# EAGLE design MJ818 clone - rev.5 - TCAN334 - prod (EAGLE 9.6.2)
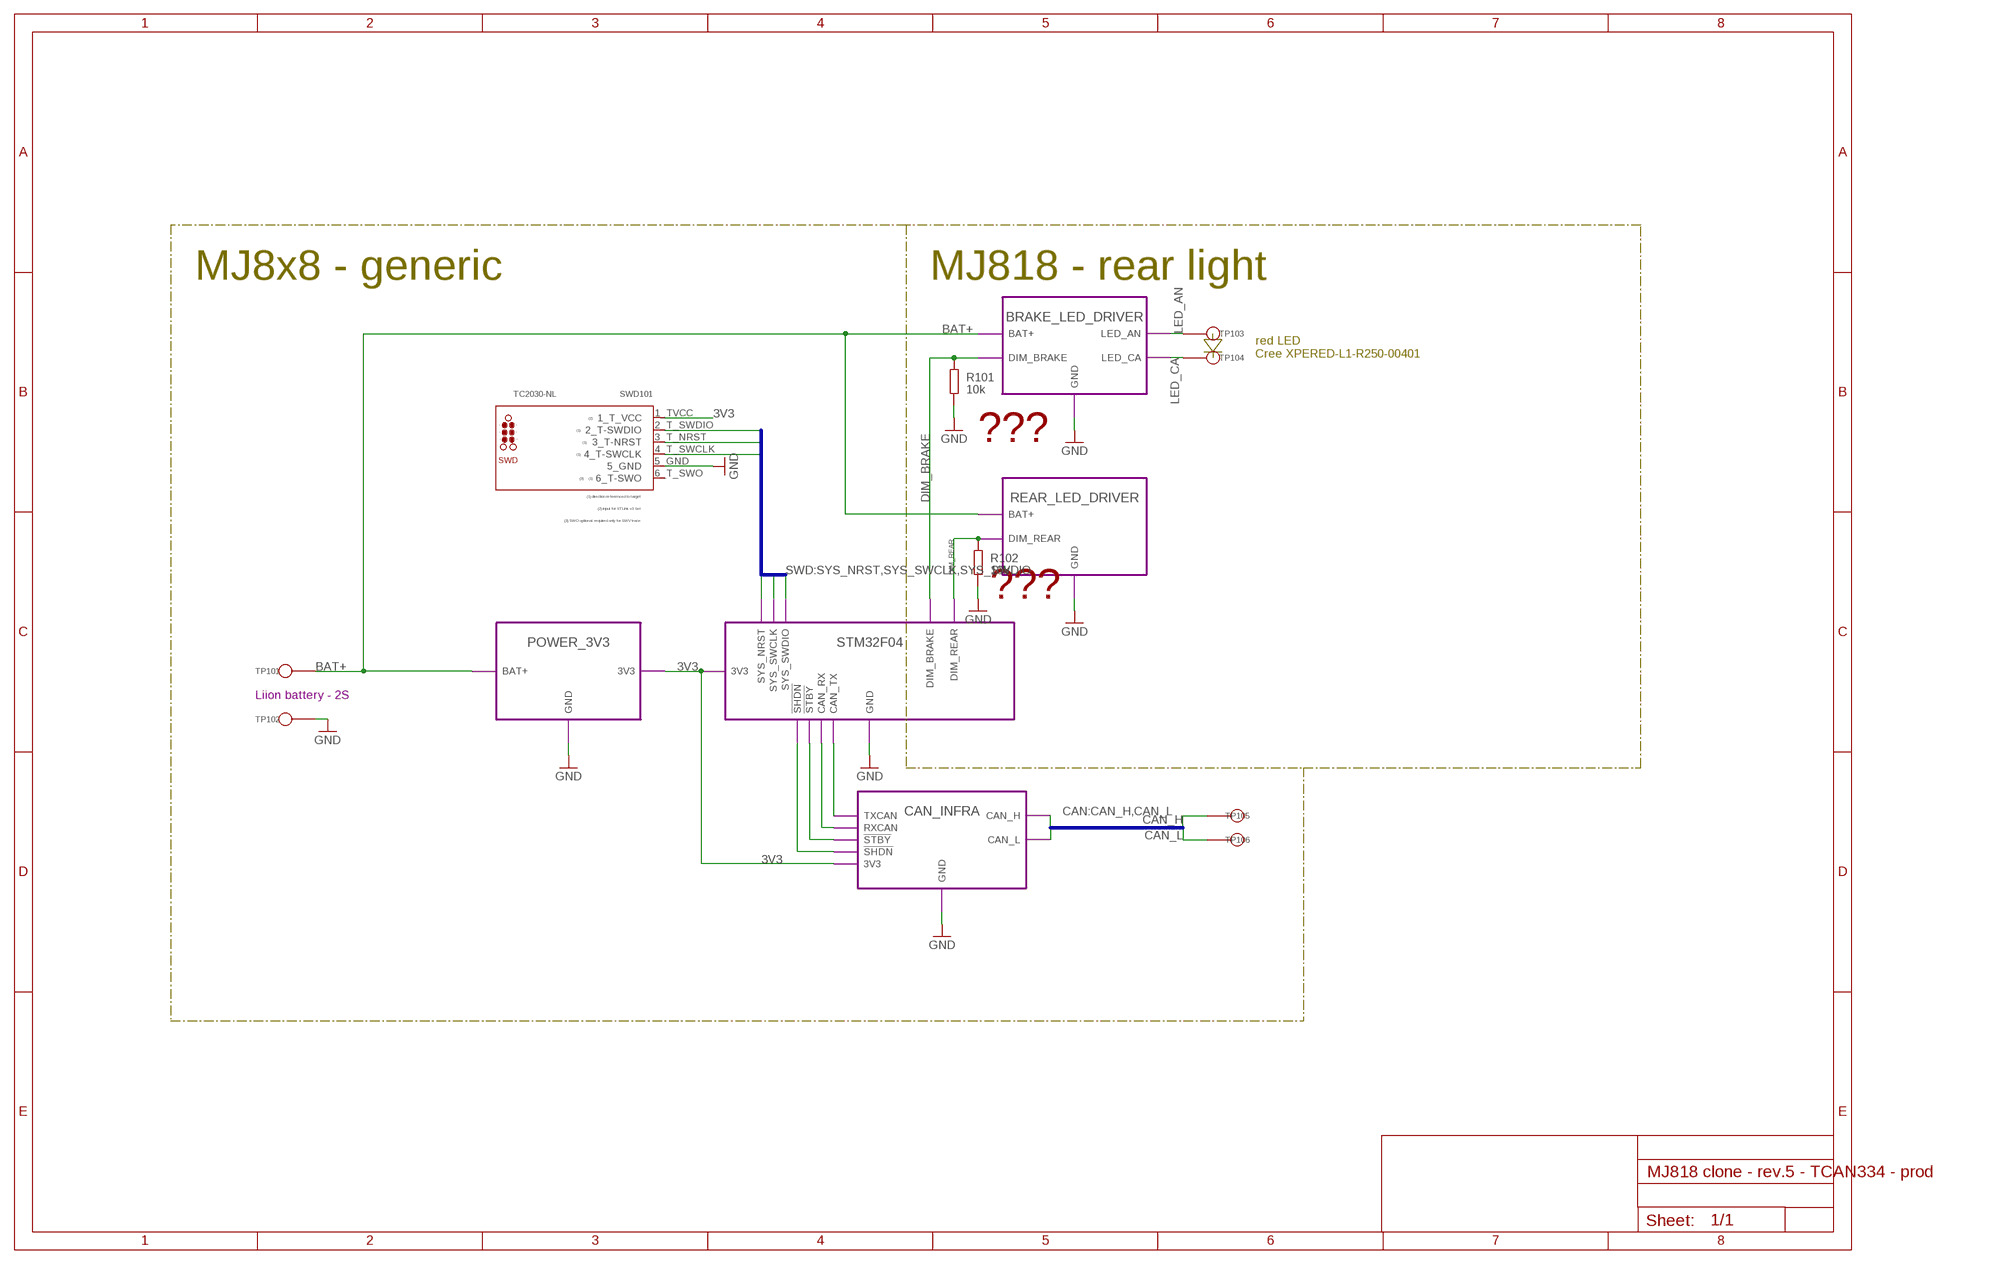
[diagram p0: schematic, sheet 1]

## Parts
R101  10k  R-EU_R0402  [R0402]
R102  10k  R-EU_R0402  [R0402]
SWD101  TC2030-NL  TC2030  [TC2030-NL]
TP101  LiIon + Terminal  TP  [TH]
TP102  LiIon - Terminal  TP  [TH]
TP103  LED anode  TP  [TH]
TP104  LED cathode  TP  [TH]
TP105  CAN high  TP  [TH]
TP106  CAN low  TP  [TH]

## Module instances
POWER_3V3 = POWER_3V3 (part numbers offset by 200)
STM32F04 = STM32 (part numbers offset by 400)
CAN_INFRA = CAN_INFRA (part numbers offset by 500)
BRAKE_LED_DRIVER = LED_DRIVER_BRAKE-LIGHT (part numbers offset by 600)
REAR_LED_DRIVER = LED_DRIVER_REAR-LIGHT (part numbers offset by 700)

## Nets
3V3 [3V3]: SWD101.1_TVCC(1_T_VCC) ; port POWER_3V3.3V3 STM32F04.3V3 CAN_INFRA.3V3
!SHDN!: port CAN_INFRA.!SHDN! STM32F04.!SHDN!
!STBY! [signal]: port CAN_INFRA.!STBY! STM32F04.!STBY!
BAT+ [BAT+]: TP101.TP$1 ; port POWER_3V3.BAT+ BRAKE_LED_DRIVER.BAT+ REAR_LED_DRIVER.BAT+
CAN_H [signal]: TP105.TP$1 ; port CAN_INFRA.CAN_H
CAN_L [signal]: TP106.TP$1 ; port CAN_INFRA.CAN_L
CAN_RX [signal]: port CAN_INFRA.RXCAN STM32F04.CAN_RX
CAN_TX [signal]: port CAN_INFRA.TXCAN STM32F04.CAN_TX
DIM_BRAKE [signal]: R101.2 ; port STM32F04.DIM_BRAKE BRAKE_LED_DRIVER.DIM_BRAKE
DIM_REAR [signal]: R102.2 ; port STM32F04.DIM_REAR REAR_LED_DRIVER.DIM_REAR
GND: R101.1 R102.1 SWD101.5_GND TP102.TP$1 ; port STM32F04.GND POWER_3V3.GND CAN_INFRA.GND BRAKE_LED_DRIVER.GND REAR_LED_DRIVER.GND
LED_AN [BAT+]: TP103.TP$1 ; port BRAKE_LED_DRIVER.LED_AN
LED_CA [BAT+]: TP104.TP$1 ; port BRAKE_LED_DRIVER.LED_CA
SYS_NRST [signal]: SWD101.3_T_NRST(3_T-NRST) ; port STM32F04.SYS_NRST
SYS_SWCLK [signal]: SWD101.4_T_SWCLK(4_T-SWCLK) ; port STM32F04.SYS_SWCLK
SYS_SWDIO [signal]: SWD101.2_T_SWDIO(2_T-SWDIO) ; port STM32F04.SYS_SWDIO
Unconnected: SWD101.6_T_SWO(6_T-SWO)

## Buses
CAN:CAN_H,CAN_L
SWD:SYS_NRST,SYS_SWCLK,SYS_SWDIO

## Notes on the sheet
- MJ8x8 - generic | MJ818 - rear light
- red LED
  Cree XPERED-L1-R250-00401
- ???
- ???
- Liion battery - 2S

## Library data of the parts
R101 R102 = rcl:R-EU_: RESISTOR, European symbol; SPICEPREFIX: R
SWD101 = tag-connect:TC2030: TC2030 pad no. Function STLink v3 CN1 pin no. Function 1 Reserved (1) 2 Reserved (1) 1 T_Vcc 3 T_Vcc (2) 2 T_SWDIO 4 T_JTMS/T_SWDIO 5 GND 4 T_SWCLK 6 T_JCLK / T_SWCLK 5 GND 7 GND 6 8 T_JTDO / T_SWO (3) 9 T_JRCLK (4) / NC (5) 10 T_JTDI / NC (5) 11 GNDDetect (6) 3 T_NRST 12 T_NRST 13 T_VCP_RX (7) 14 T_VCP_TX (2) (1) Do not connect to the target (2) Input for STLINK-V3SET (3) SWO is optional, required only for Serial Wire Viewer (SWV) trace (4) Optional loopback of T_JCLK on the target side, required if loopback is removed on the STLINK-V3SET side (5) NC means not required for the SWD connection (6) Tied to GND by STLINK-V3SET firmware; may be used by the target for detection of the tool (7) Output for STLINK-V3SET
TP101-TP106 = signal testpoint:TP

## Module POWER_3V3
Ports: GND(pwr) BAT+(pwr) 3V3(pwr)
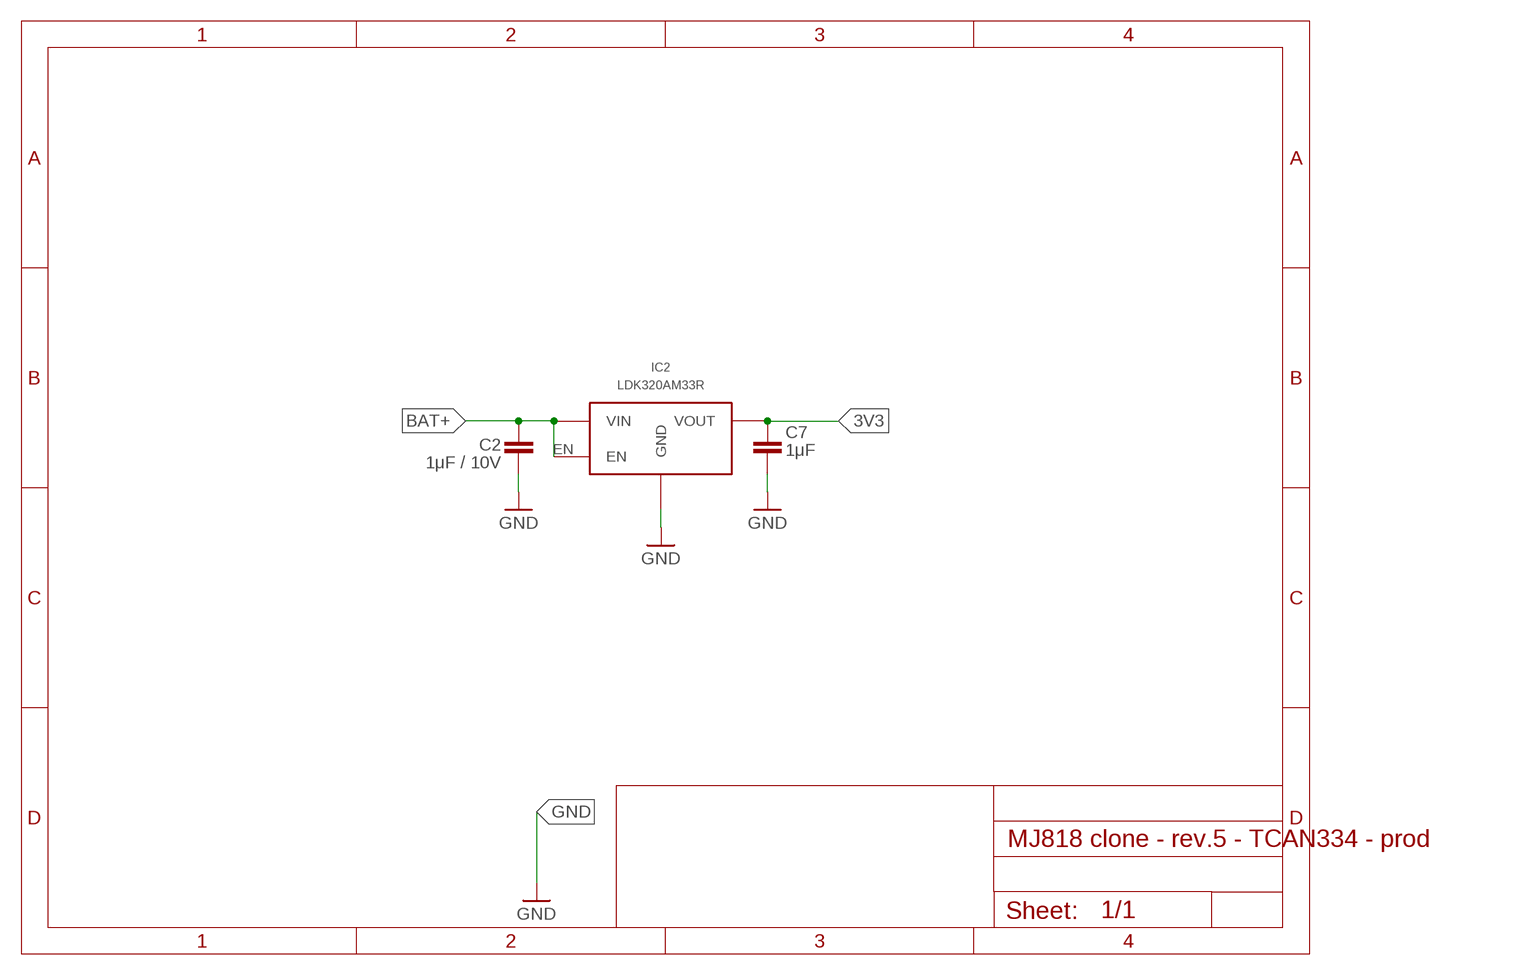
[diagram p1: schematic, module POWER_3V3, sheet 1]

### Parts
C2  1μF / 10V  C-EUC0402  [C0402]
C7  1μF  C-EUC0402  [C0402]
IC2  LDK320AM33R  LDK320SOT-23-5L  [SOT-23-5L]

### Nets
3V3: C7.2 IC2.OUT(VOUT)
BAT+ [BAT+]: C2.1 IC2.EN IC2.IN(VIN)
GND: C2.2 C7.1 IC2.GND

### Library data of the parts
C2 C7 = rcl:C-EU: CAPACITOR, European symbol; SPICEPREFIX: C
IC2 = LDK320 5V LDO:LDK320

## Module STM32
Ports: GND(pwr) 3V3(pwr) SYS_NRST(in) SYS_SWCLK(io) SYS_SWDIO(io) CAN_RX(in) CAN_TX(out) !STBY!(out) DIM_REAR(out) DIM_BRAKE(out) !SHDN!(out)
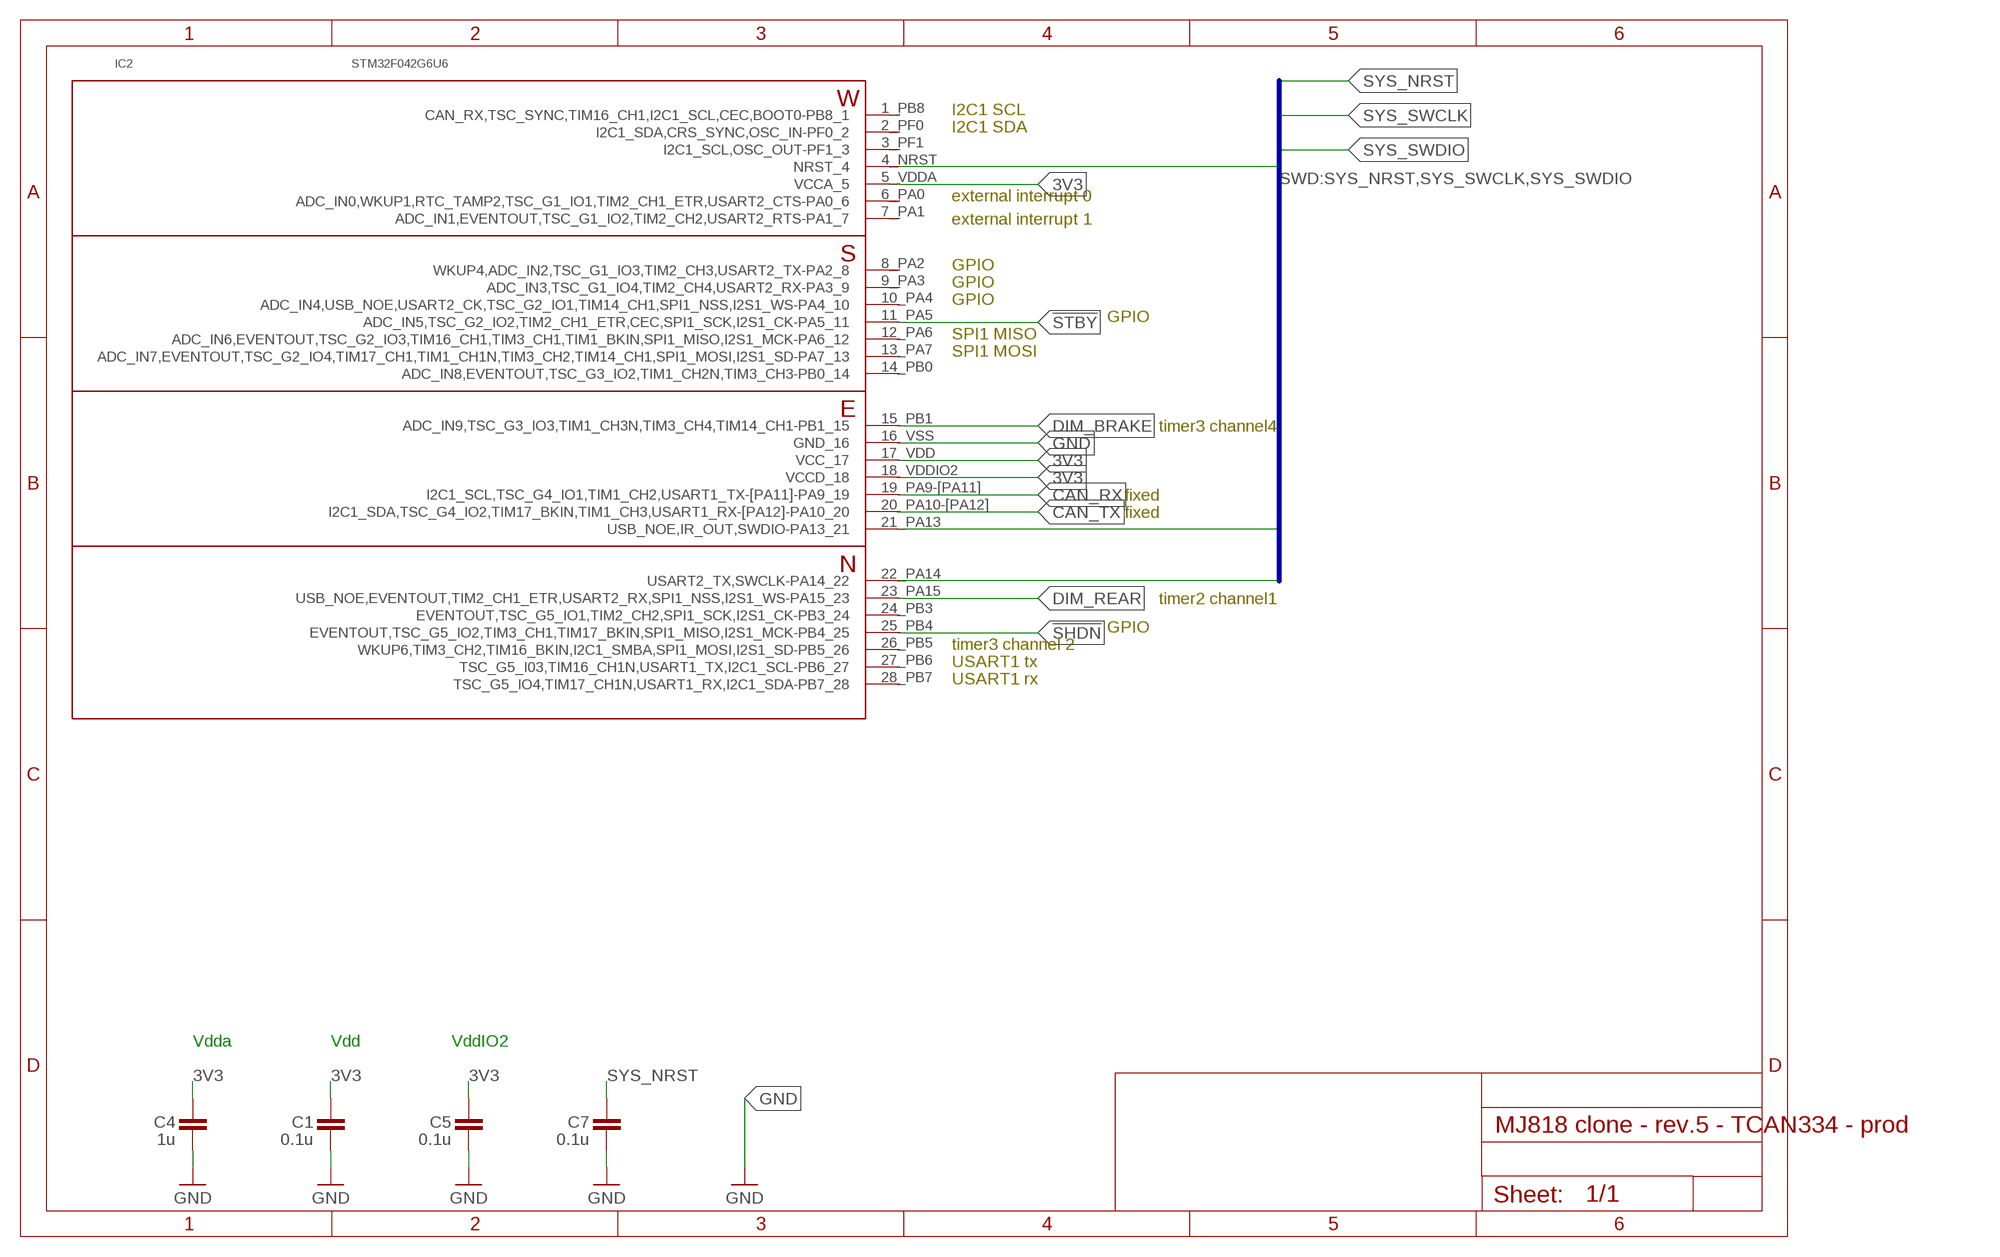
[diagram p2: schematic, module STM32, sheet 1]

### Parts
C1  0.1u  C-EUC0402  [C0402]
C4  1u  C-EUC0402  [C0402]
C5  0.1u  C-EUC0402  [C0402]
C7  0.1u  C-EUC0402  [C0402]
IC2  STM32F042G6U6  STM32F042G6  [UFQFPN-28]

### Nets
3V3 [3V3]: C1.2 C4.2 C5.2 IC2.5_VDDA(VCCA_5) IC2.17_VDD(VCC_17) IC2.18_VDDIO2(VCCD_18)
!SHDN!: IC2.25_PB4(EVENTOUT,TSC_G5_IO2,TIM3_CH1,TIM17_BKIN,SPI1_MISO,I2S1_MCK-PB4_25)
!STBY!: IC2.11_PA5(ADC_IN5,TSC_G2_IO2,TIM2_CH1_ETR,CEC,SPI1_SCK,I2S1_CK-PA5_11)
CAN_RX: IC2.19_PA9-[PA11](I2C1_SCL,TSC_G4_IO1,TIM1_CH2,USART1_TX-[PA11]-PA9_19)
CAN_TX: IC2.20_PA10-[PA12](I2C1_SDA,TSC_G4_IO2,TIM17_BKIN,TIM1_CH3,USART1_RX-[PA12]-PA10_20)
DIM_BRAKE: IC2.15_PB1(ADC_IN9,TSC_G3_IO3,TIM1_CH3N,TIM3_CH4,TIM14_CH1-PB1_15)
DIM_REAR: IC2.23_PA15(USB_NOE,EVENTOUT,TIM2_CH1_ETR,USART2_RX,SPI1_NSS,I2S1_WS-PA15_23)
GND: C1.1 C4.1 C5.1 C7.1 IC2.16_VSS(GND_16)
SYS_NRST: C7.2 IC2.4_NRST(NRST_4)
SYS_SWCLK: IC2.22_PA14(USART2_TX,SWCLK-PA14_22)
SYS_SWDIO: IC2.21_PA13(USB_NOE,IR_OUT,SWDIO-PA13_21)
Unconnected: IC2.1_PB8(CAN_RX,TSC_SYNC,TIM16_CH1,I2C1_SCL,CEC,BOOT0-PB8_1) IC2.2_PF0(I2C1_SDA,CRS_SYNC,OSC_IN-PF0_2) IC2.3_PF1(I2C1_SCL,OSC_OUT-PF1_3) IC2.6_PA0(ADC_IN0,WKUP1,RTC_TAMP2,TSC_G1_IO1,TIM2_CH1_ETR,USART2_CTS-PA0_6) IC2.7_PA1(ADC_IN1,EVENTOUT,TSC_G1_IO2,TIM2_CH2,USART2_RTS-PA1_7) IC2.8_PA2(WKUP4,ADC_IN2,TSC_G1_IO3,TIM2_CH3,USART2_TX-PA2_8) IC2.9_PA3(ADC_IN3,TSC_G1_IO4,TIM2_CH4,USART2_RX-PA3_9) IC2.10_PA4(ADC_IN4,USB_NOE,USART2_CK,TSC_G2_IO1,TIM14_CH1,SPI1_NSS,I2S1_WS-PA4_10) IC2.12_PA6(ADC_IN6,EVENTOUT,TSC_G2_IO3,TIM16_CH1,TIM3_CH1,TIM1_BKIN,SPI1_MISO,I2S1_MCK-PA6_12) IC2.13_PA7(ADC_IN7,EVENTOUT,TSC_G2_IO4,TIM17_CH1,TIM1_CH1N,TIM3_CH2,TIM14_CH1,SPI1_MOSI,I2S1_SD-PA7_13) IC2.14_PB0(ADC_IN8,EVENTOUT,TSC_G3_IO2,TIM1_CH2N,TIM3_CH3-PB0_14) IC2.24_PB3(EVENTOUT,TSC_G5_IO1,TIM2_CH2,SPI1_SCK,I2S1_CK-PB3_24) IC2.26_PB5(WKUP6,TIM3_CH2,TIM16_BKIN,I2C1_SMBA,SPI1_MOSI,I2S1_SD-PB5_26) IC2.27_PB6(TSC_G5_I03,TIM16_CH1N,USART1_TX,I2C1_SCL-PB6_27) IC2.28_PB7(TSC_G5_IO4,TIM17_CH1N,USART1_RX,I2C1_SDA-PB7_28)

### Buses
SWD:SYS_NRST,SYS_SWCLK,SYS_SWDIO

### Notes on the sheet
- I2C1 SCL
- I2C1 SDA
- external interrupt 0
- external interrupt 1
- GPIO
- GPIO
- GPIO
- GPIO
- SPI1 MISO
- SPI1 MOSI
- timer3 channel4
- fixed
- fixed
- timer2 channel1
- GPIO
- timer3 channel 2
- USART1 tx
- USART1 rx
- Vdda | Vdd | VddIO2

### Library data of the parts
C1 C4 C5 C7 = rcl:C-EU: CAPACITOR, European symbol; SPICEPREFIX: C
IC2 = STM32F042G6:STM32F042G6

## Module CAN_INFRA
Ports: GND(pwr) 3V3(pwr) CAN_H(io) CAN_L(io) TXCAN(in) RXCAN(out) !STBY!(in) !SHDN!(in)
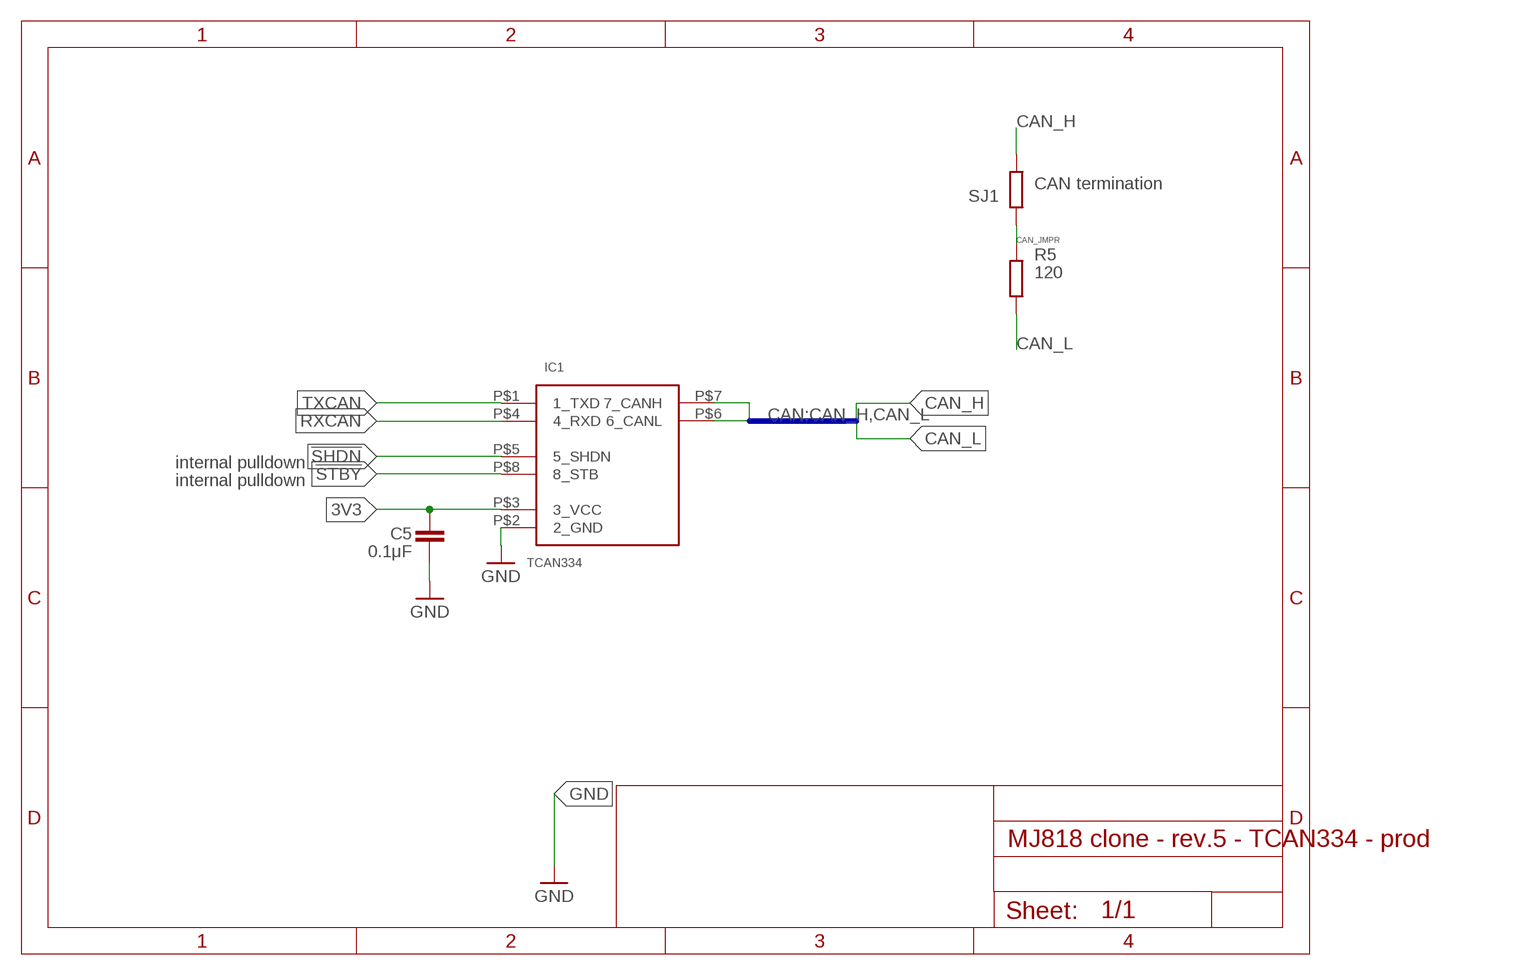
[diagram p3: schematic, module CAN_INFRA, sheet 1]

### Parts
C5  0.1μF  C-EUC0402  [C0402]
IC1  TCAN334  CAN33X  [SOT23-8]
R5  120  R-EU_R0805  [R0805]
SJ1  CAN termination  R-EU_R0402  [R0402]

### Nets
3V3 [3V3]: C5.1 IC1.P$3(3_VCC)
!SHDN!: IC1.P$5(5_SHDN)
!STBY! [signal]: IC1.P$8(8_STB)
CAN_H: IC1.P$7(7_CANH) SJ1.2
CAN_JMPR [signal]: R5.2 SJ1.1
CAN_L: IC1.P$6(6_CANL) R5.1
GND: C5.2 IC1.P$2(2_GND)
RXCAN [signal]: IC1.P$4(4_RXD)
TXCAN [signal]: IC1.P$1(1_TXD)

### Buses
CAN:CAN_H,CAN_L

### Notes on the sheet
- internal pulldown
- internal pulldown

### Library data of the parts
C5 = rcl:C-EU: CAPACITOR, European symbol; SPICEPREFIX: C
IC1 = TCAN33x - 3.3V CAN Transciever:CAN33X
R5 SJ1 = rcl:R-EU_: RESISTOR, European symbol; SPICEPREFIX: R

## Module LED_DRIVER_BRAKE-LIGHT
Ports: GND(pwr) LED_AN(pwr) LED_CA(pwr) DIM_BRAKE(in) BAT+(pwr)
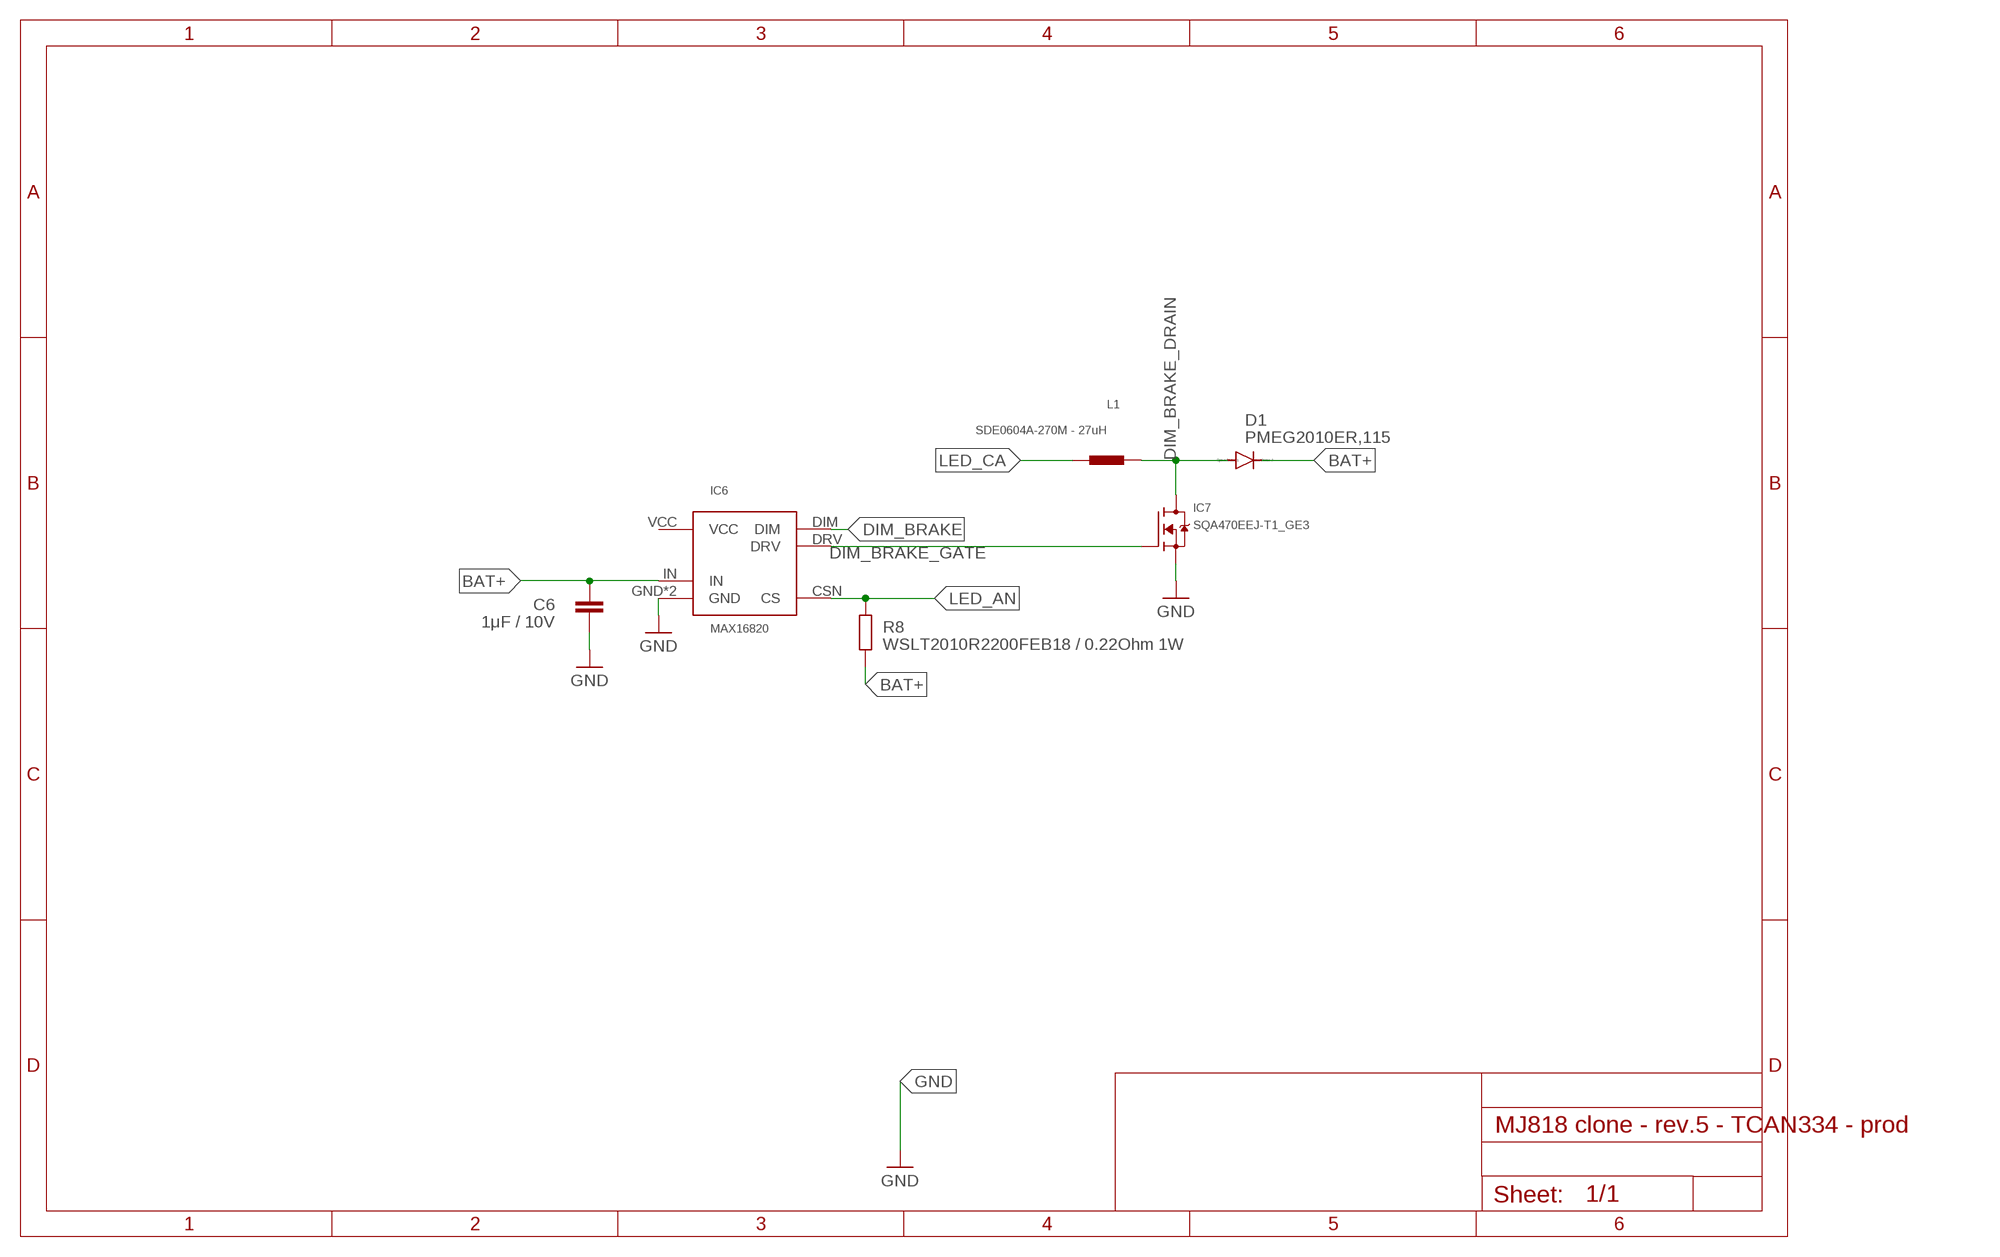
[diagram p4: schematic, module LED_DRIVER_BRAKE-LIGHT, sheet 1]

### Parts
C6  1μF / 10V  C-EUC0402  [C0402]
D1  PMEG2010ER,115  DIODE-SOD123  [SOD123]
IC6  MAX16820  [TDFN-6-EP]
IC7  SQA470EEJ-T1_GE3  SIA456DJ  [SC-70-6]
L1  SDE0604A-270M - 27uH  DE0604A-778075  [SMT]
R8  WSLT2010R2200FEB18 / 0.22Ohm 1W  R-EU_R2010  [R2010]

### Nets
BAT+ [BAT+]: C6.1 D1.C IC6.IN R8.2
DIM_BRAKE [signal]: IC6.DIM
DIM_BRAKE_DRAIN [signal]: D1.A IC7.1D(D) IC7.2D(D) IC7.5D(D) IC7.6D(D) IC7.D L1.P$2
DIM_BRAKE_GATE [signal]: IC6.DRV IC7.3G(G)
GND: C6.2 IC6.GND IC6.GND1(GND) IC7.4S(S) IC7.S
LED_AN [BAT+]: IC6.CSN(CS) R8.1
LED_CA [BAT+]: L1.P$1

### Power pins joined to a net without a drawn wire
VCC: IC6.VCC

### Library data of the parts
C6 = rcl:C-EU: CAPACITOR, European symbol; SPICEPREFIX: C
D1 = diode:DIODE-: DIODE
IC6 = MAX16820 LED Driver, constant current:MAX16820
IC7 = SIA456DJ-T1-GE3  N-Fet:SIA456DJ
L1 = DE0604A-778075 - Inductor:DE0604A-778075
R8 = rcl:R-EU_: RESISTOR, European symbol; SPICEPREFIX: R

## Module LED_DRIVER_REAR-LIGHT
Ports: GND(pwr) BAT+(pwr) DIM_REAR(in)
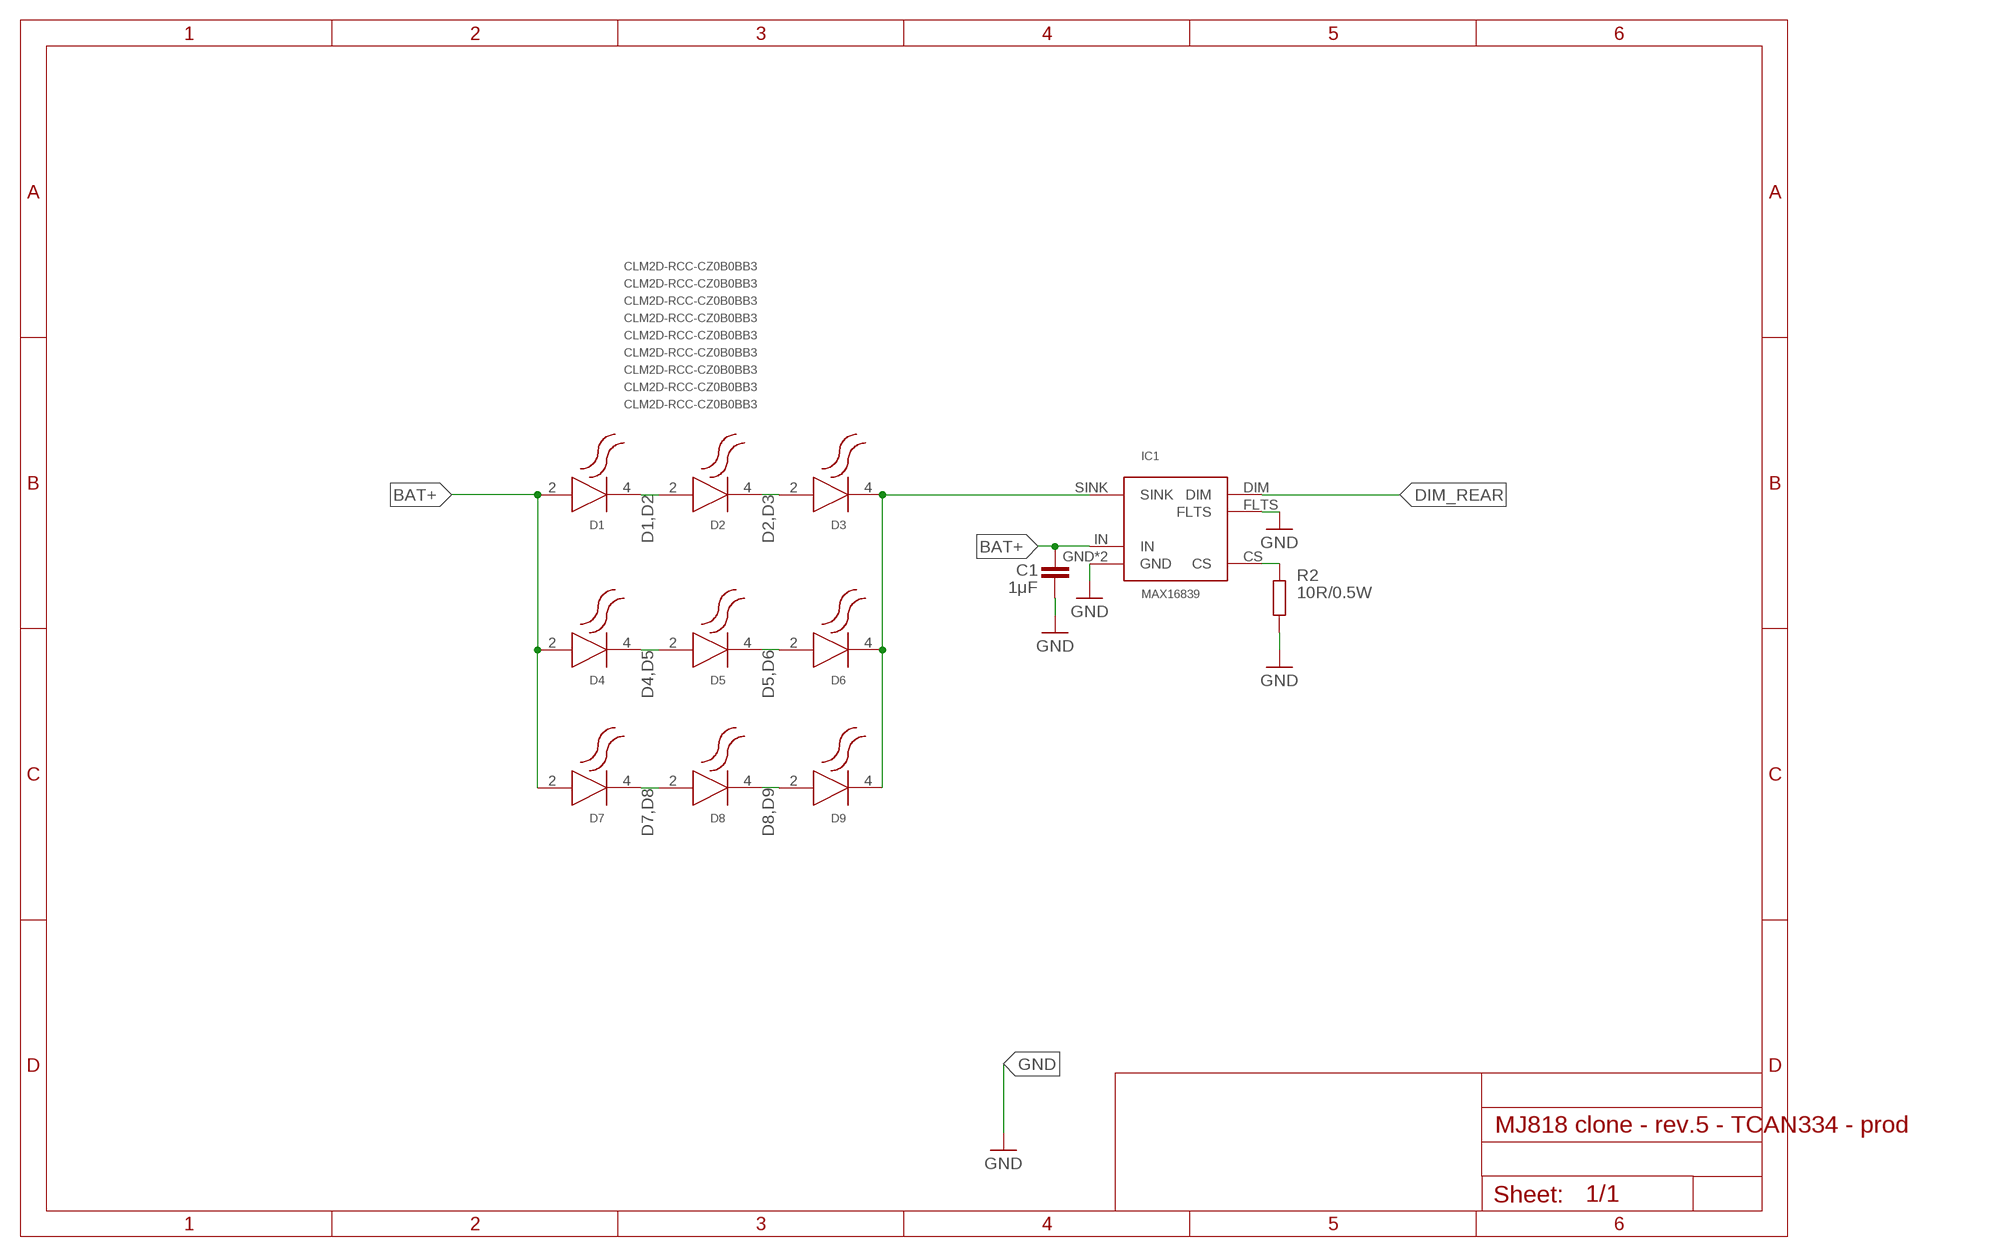
[diagram p5: schematic, module LED_DRIVER_REAR-LIGHT, sheet 1]

### Parts
C1  1μF  C-EUC0402  [C0402]
D1  CLM2D-RCC-CZ0B0BB3  1374-CLM2D-RCC-ACC-1064252  [SMD]
D2  CLM2D-RCC-CZ0B0BB3  1374-CLM2D-RCC-ACC-1064252  [SMD]
D3  CLM2D-RCC-CZ0B0BB3  1374-CLM2D-RCC-ACC-1064252  [SMD]
D4  CLM2D-RCC-CZ0B0BB3  1374-CLM2D-RCC-ACC-1064252  [SMD]
D5  CLM2D-RCC-CZ0B0BB3  1374-CLM2D-RCC-ACC-1064252  [SMD]
D6  CLM2D-RCC-CZ0B0BB3  1374-CLM2D-RCC-ACC-1064252  [SMD]
D7  CLM2D-RCC-CZ0B0BB3  1374-CLM2D-RCC-ACC-1064252  [SMD]
D8  CLM2D-RCC-CZ0B0BB3  1374-CLM2D-RCC-ACC-1064252  [SMD]
D9  CLM2D-RCC-CZ0B0BB3  1374-CLM2D-RCC-ACC-1064252  [SMD]
IC1  MAX16839  MAX16839  [TDFN-6-EP]
R2  10R/0.5W  R-EU_R0603  [R0603]

### Nets
BAT+ [BAT+]: C1.2 D1.2(A) D4.2(A) D7.2(A) IC1.IN
CS [BAT+]: IC1.CS R2.1
D1,D2 [BAT+]: D1.4(C) D2.2(A)
D2,D3 [BAT+]: D2.4(C) D3.2(A)
D4,D5 [BAT+]: D4.4(C) D5.2(A)
D5,D6 [BAT+]: D5.4(C) D6.2(A)
D7,D8 [BAT+]: D7.4(C) D8.2(A)
D8,D9 [BAT+]: D8.4(C) D9.2(A)
DIM_REAR [signal]: IC1.DIM
GND: C1.1 IC1.FLTS IC1.GND IC1.GND1(GND) R2.2
SINK [BAT+]: D3.4(C) D6.4(C) D9.4(C) IC1.SINK

### Library data of the parts
C1 = rcl:C-EU: CAPACITOR, European symbol; SPICEPREFIX: C
D1-D9 = 1374-CLM2D-RCC-ACC-1064252 - Red SMD LED:1374-CLM2D-RCC-ACC-1064252
IC1 = MAX16839 LED Driver, constant current:MAX16839
R2 = rcl:R-EU_: RESISTOR, European symbol; SPICEPREFIX: R

## Net classes
0 GND: width 0.25 mm, drill 0.35 mm, clearance 0.19 mm
1 BAT+: width 0.4 mm, drill 0.35 mm, clearance 0.19 mm
3 signal: width 0.25 mm, drill 0.35 mm, clearance 0.19 mm
4 3V3: width 0.25 mm, drill 0.35 mm, clearance 0.19 mm

## Board
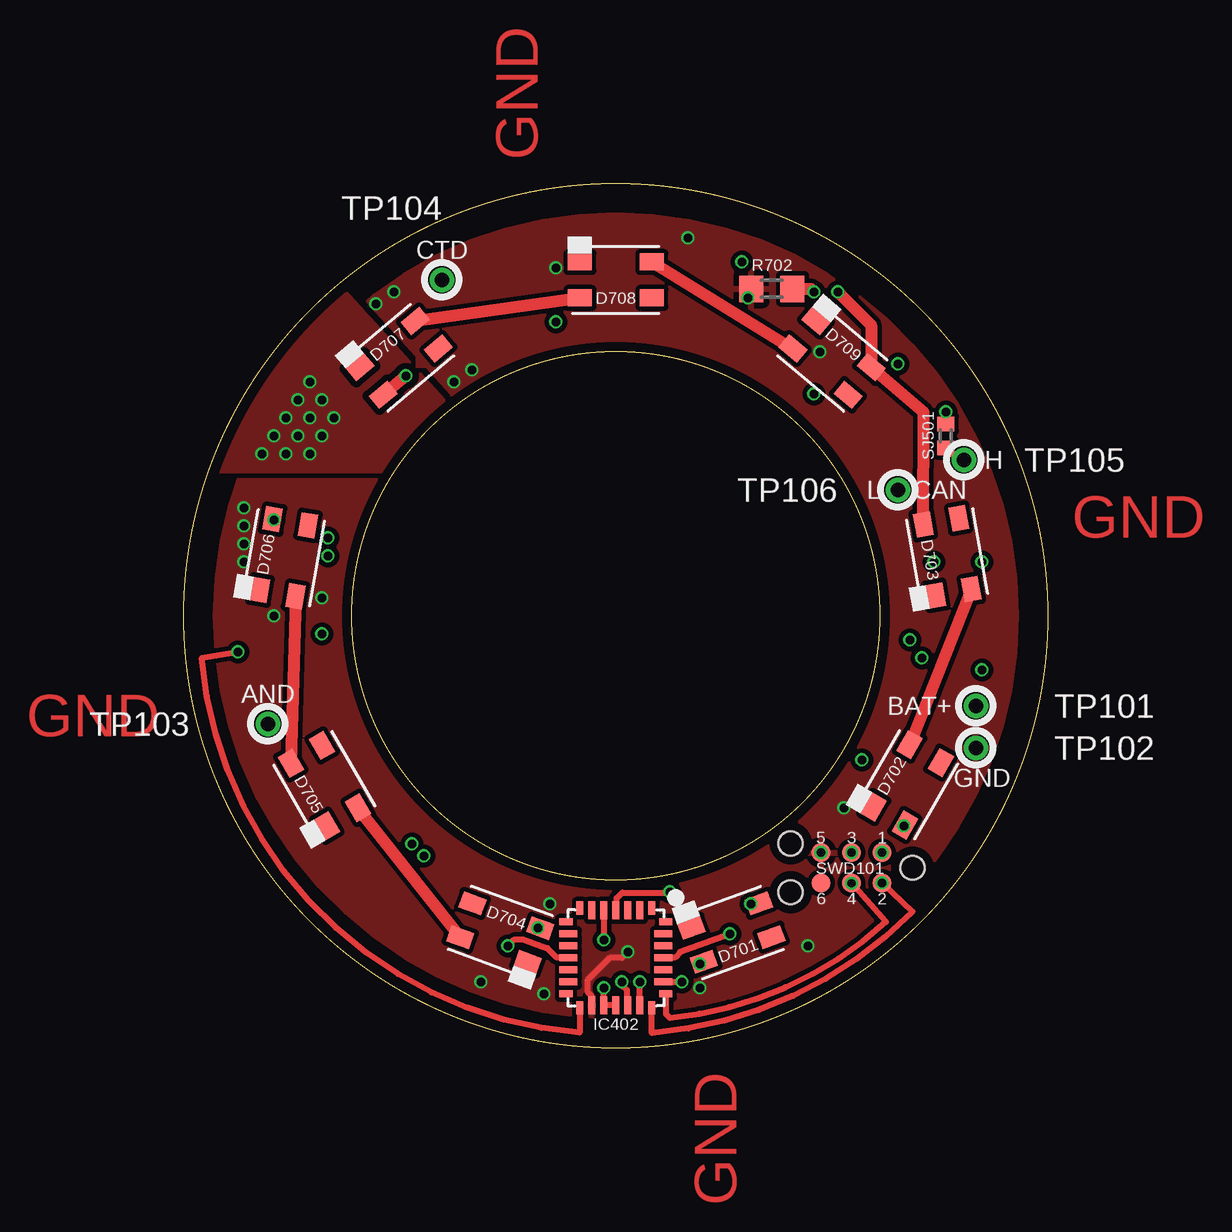
[diagram p6: board, top side]
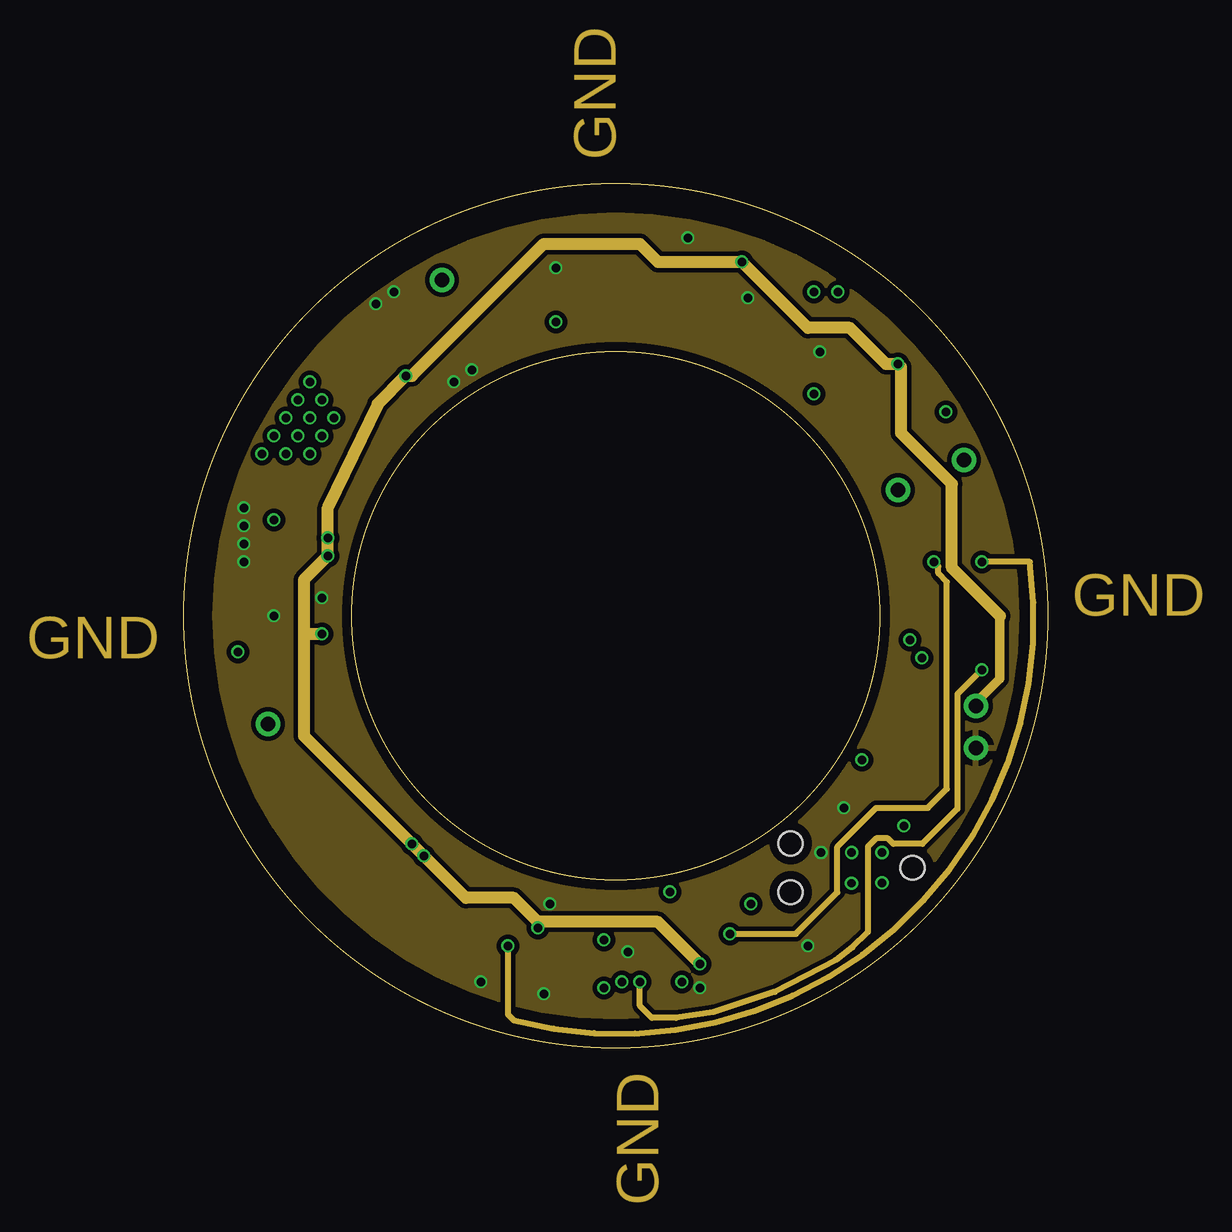
[diagram p7: board, inner layer Route2]
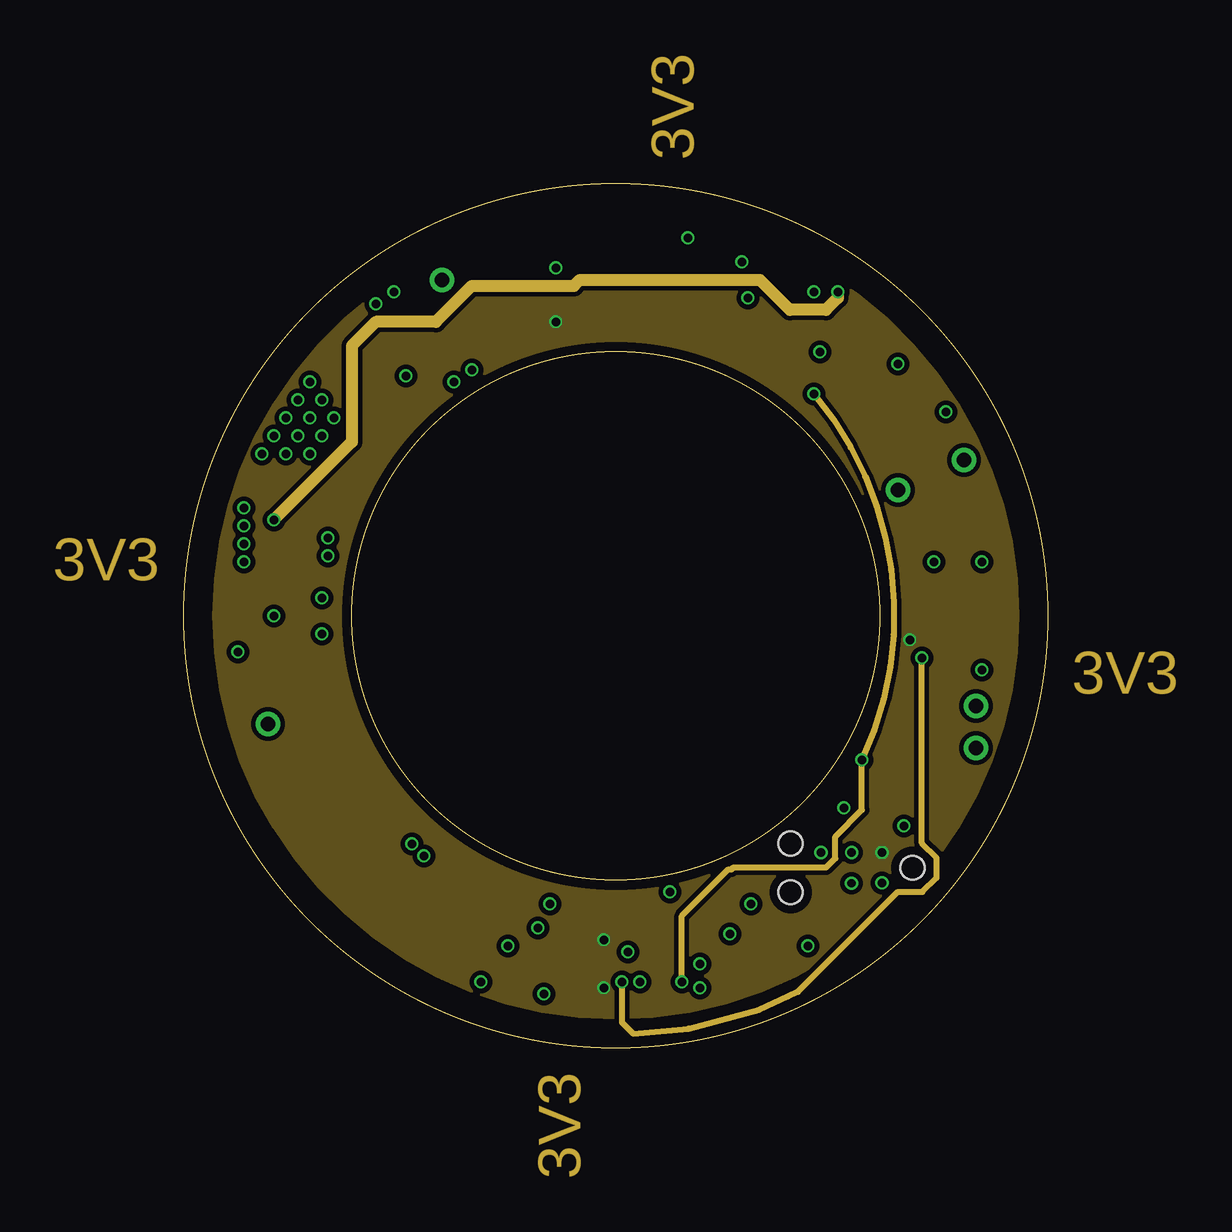
[diagram p8: board, inner layer Route15]
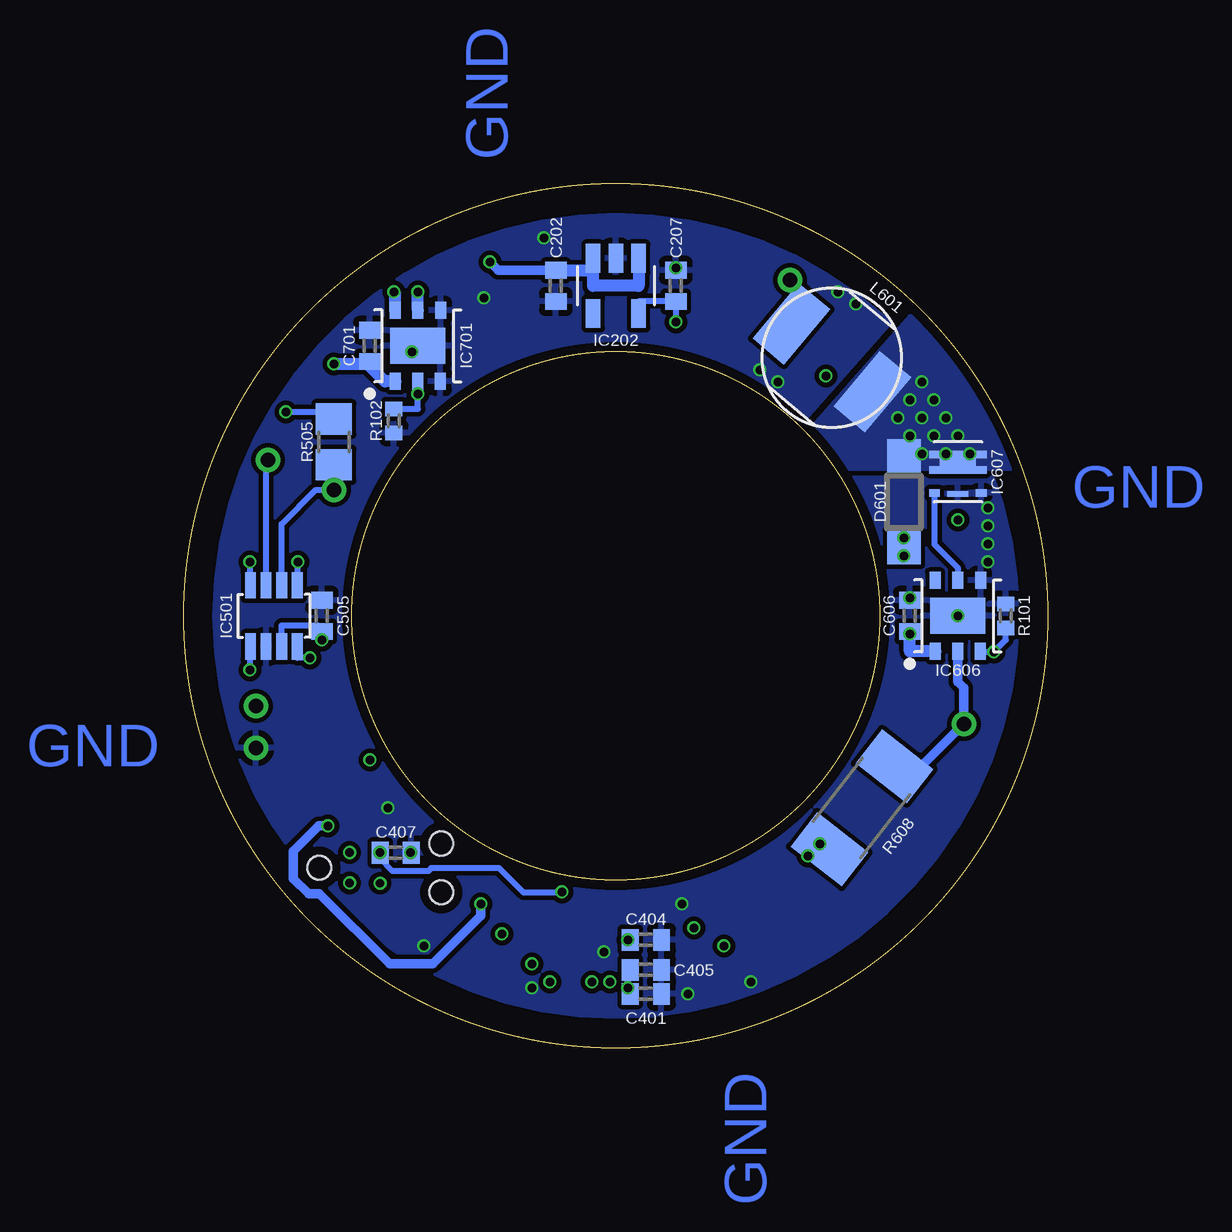
[diagram p9: board, bottom side, seen from below]

Size 36 x 36 mm. Coordinates in mm from the lower left corner, seen from the top.
Outline: circle at 18,18 radius 11
Outline: circle at 18,18 radius 18
Copper layers (1*2*15*16): Top 0.035559375mm / dielectric 0.17018125mm / Route2 0.01778125mm / dielectric 47mil / Route15 0.01778125mm / dielectric 0.17018125mm / Bottom 0.035559375mm
Design rules "oshpark-4layer": minimum track width 5mil, minimum drill 10mil, track to track 5mil, track to pad 5mil, pad to pad 5mil, via to via 5mil, smd to smd 5mil, copper to edge 15mil, drill to drill 6mil, minimum pad ring 4mil, minimum via ring 4mil, stop-mask expansion 1.5mil, vias tented up to drill 0mil, thermal gap 10mil
tKeepout: 4 lines
bKeepout: area 0.4,0.4 to 35.6,35.6
bRestrict: 4 lines

### Footprints (pad centres in the part's own frame; a part is rotated, then mirrored left to right if it is on the bottom)
C0402 = smd 0.7 x 0.9: 1 -0.65,0; 2 0.65,0
SOD123 = smd 1.4 x 1.4: A 1.9,0; C -1.9,0
SMD = smd 1 x 0.7: 1 -1.5,0.75; 2 -1.5,-0.75; 3 1.5,-0.75; 4 1.5,0.75
SOT-23-5L = smd 0.6 x 1.2: ADJ/NC -0.95,-1.15; EN -0.95,1.15; GND 0,1.15; IN 0.95,1.15; OUT 0.95,-1.15
UFQFPN-28 = smd 0.55 x 0.3: 1_PB8 -2.08,1.5; 7_PA1 -2.08,-1.5; 15_PB1 2.08,-1.5; 21_PA13 2.08,1.5 | smd 0.75 x 0.3: 2_PF0 -1.98,1; 3_PF1 -1.98,0.5; 4_NRST -1.98,0; 5_VDDA -1.98,-0.5; 6_PA0 -1.98,-1; 16_VSS 1.98,-1; 17_VDD 1.98,-0.5; 18_VDDIO2 1.98,0; 19_PA9-[PA11] 1.98,0.5; 20_PA10-[PA12] 1.98,1 | smd 0.3 x 0.55: 8_PA2 -1.5,-2.08; 14_PB0 1.5,-2.08; 22_PA14 1.5,2.08; 28_PB7 -1.5,2.08 | smd 0.3 x 0.75: 9_PA3 -1,-1.98; 10_PA4 -0.5,-1.98; 11_PA5 0,-1.98; 12_PA6 0.5,-1.98; 13_PA7 1,-1.98; 23_PA15 1,1.98; 24_PB3 0.5,1.98; 25_PB4 0,1.98; 26_PB5 -0.5,1.98; 27_PB6 -1,1.98
SOT23-8 = smd 0.45 x 1.1: P$1 -0.975,-1.275; P$2 -0.325,-1.275; P$3 0.325,-1.275; P$4 0.975,-1.275; P$5 0.975,1.275; P$6 0.325,1.275; P$7 -0.325,1.275; P$8 -0.975,1.275
TDFN-6-EP = smd 0.71 x 0.46: CSN -1.48,0; DIM -1.48,-0.94; DRV 1.48,0; GND1 1.48,-0.95; IN -1.48,0.94; VCC 1.48,0.95 | smd 1.5 x 2.3: GND 0,0
SC-70-6 = smd 0.45 x 0.3: 1D -0.975,0.725; 2D -0.975,0.075; 3G -0.975,-0.88; 4S 0.975,-0.88; 5D 0.975,0.075; 6D 0.975,0.725 | smd 1.5 x 0.95: D 0,0.4 | smd 0.87 x 0.23: S 0,-0.915
TDFN-6-EP' = smd 0.71 x 0.46: CS 1.48,0; DIM -1.48,0; FLTS -1.48,-0.94; GND1 1.48,-0.95; IN -1.48,0.94; SINK 1.48,0.95 | smd 1.5 x 2.3: GND 0,0
SMT = smd 1.7 x 3: P$1 2.2,0; P$2 -2.2,0
R0402 = smd 0.6 x 0.7: 1 -0.5,0; 2 0.5,0
R0805 = smd 1.3 x 1.5: 1 -0.95,0; 2 0.95,0
R2010 = smd 1.8 x 2.7: 1 -2.2,0; 2 2.2,0
R0603 = smd 1 x 1.1: 1 -0.85,0; 2 0.85,0
TC2030-NL = smd 0.787 x 0.787: 1_TVCC 1.27,-0.635; 2_T_SWDIO 1.27,0.635; 3_T_NRST 2.54,-0.635; 4_T_SWCLK 2.54,0.635; 5_GND 3.81,-0.635; 6_T_SWO 3.81,0.635 | hole 0.991: 0,0; 5.08,-1.016; 5.08,1.016
TH = drill 0.6 pad 1.016: TP$1 0,0

### Placement (x,y rotation side)
C202  1μF / 10V  [C0402]  20.5,31.75 270 bottom
C207  1μF  [C0402]  15.5,31.75 270 bottom
C401  0.1u  [C0402]  16.75,2.25 180 bottom
C404  1u  [C0402]  16.75,4.5 180 bottom
C405  0.1u  [C0402]  16.75,3.25 180 bottom
C407  0.1u  [C0402]  27.17,8.13 180 bottom
C505  0.1μF  [C0402]  30.25,18 90 bottom
C606  1μF / 10V  [C0402]  5.75,18 90 bottom
C701  1μF  [C0402]  28.25,29.25 270 bottom
D601  PMEG2010ER,115  [SOD123]  6,22.75 90 bottom
D701  CLM2D-RCC-CZ0B0BB3  [SMD]  22.82,4.8 20 top
D702  CLM2D-RCC-CZ0B0BB3  [SMD]  30.14,10.96 60 top
D703  CLM2D-RCC-CZ0B0BB3  [SMD]  31.81,20.46 100 top
D704  CLM2D-RCC-CZ0B0BB3  [SMD]  13.18,4.8 160 top
D705  CLM2D-RCC-CZ0B0BB3  [SMD]  5.86,10.93 120 top
D706  CLM2D-RCC-CZ0B0BB3  [SMD]  4.18,20.43 80 top
D707  CLM2D-RCC-CZ0B0BB3  [SMD]  8.97,28.75 40 top
D708  CLM2D-RCC-CZ0B0BB3  [SMD]  18,32 0 top
D709  CLM2D-RCC-CZ0B0BB3  [SMD]  27.01,28.75 320 top
IC202  LDK320AM33R  [SOT-23-5L]  18,31.75 0 bottom
IC402  STM32F042G6U6  [UFQFPN-28]  18,3.75 270 top
IC501  TCAN334  [SOT23-8]  32.25,18 0 bottom
IC606  MAX16820  [TDFN-6-EP]  3.75,18 90 bottom
IC607  SQA470EEJ-T1_GE3  [SC-70-6]  3.75,24 0 bottom
IC701  MAX16839  [TDFN-6-EP']  26.25,29.25 90 bottom
L601  SDE0604A-270M - 27uH  [SMT]  9,28.75 140 bottom
R101  1.75,18 270 bottom
R102  27.25,26.12 90 bottom
R505  120  [R0805]  29.75,25.25 90 bottom
R608  WSLT2010R2200FEB18 / 0.22Ohm 1W  [R2010]  7.75,10 232 bottom
R702  10R/0.5W  [R0603]  24.5,31.62 180 top
SJ501  CAN termination  [R0402]  31.75,25.5 270 top
SWD101  30.36,7.5 180 top
TP101  33,14.25 0 top
TP102  33,12.5 0 top
TP103  3.5,13.5 0 top
TP104  10.75,32 0 top
TP105  32.5,24.5 0 top
TP106  29.75,23.25 0 top

### Tracks (layer width: path | path; a pad name or v marks a point on that pad's centre or on a via)
3V3  (via drill 0.35)
  Top 0.25: IC402.5_VDDA v17.5,4.5 | SWD101.1_TVCC v29.09,8.14 | IC402.18_VDDIO2 IC402.17_VDD v17.5,2.5
  Bottom 0.25: IC202.OUT 17.05,31.1 C207.2 v15.5,30.25 | C405.2 17.5,3.15 v17.5,2.5 17.4,2.4 C401.2 | C404.2 v17.5,4.5 | v30.25,17 C505.1 30.25,17.42 30.42,17.59 31.94,17.59 IC501.P$3
  pour Route15: 34.75,18 arc90 18,34.75 arc90 1.25,18 arc90 18,1.25 arc90
!SHDN!  (via drill 0.35)
  Top 0.25: v22.75,4.75 20.67,4 20.67,3.97 20.48,3.79 20.02,3.79 IC402.25_PB4
  Route2 0.25: v22.75,4.75 25.5,4.75 27.23,6.48 27.23,8.38 28.85,10 31,10 31.8,10.79 31.8,19.41 31.44,19.77 31.44,20.07 v31.25,20.25
  Bottom 0.25: IC501.P$5 31.27,20.23 v31.25,20.25
!STBY!  (via drill 0.35)
  Top 0.25: v13.5,4.25 13.75,4.5 14.19,4.5 15.15,4.15 15.52,3.79 15.98,3.79 IC402.11_PA5
  Route2 0.25: v13.5,4.25 13.5,1.39 13.75,1.14 arc112 35.25,20.25 v33.25,20.25
  Bottom 0.25: IC501.P$8 33.23,20.23 v33.25,20.25
BAT+  (via drill 0.35)
  Top 0.5: D707.2 v9.25,28 | v14.75,5 v14.76,4.99 D704.2 | D701.2 21.57,3.5 v21.5,3.5
  Route2 0.4: 33,14.38 34,15.38 34,18
  Route2 0.5: v21.5,3.5 19.75,5.25 14.75,5.25 | 5,17.25 5,19.5 v6,20.5 v6,21.25 6,22.52 8.07,26.82 v9.25,28 9.5,28 15,33.5 19,33.5 19.75,32.75 v23.25,32.75 26,30 27.75,30 29.25,28.5 v29.75,28.5 29.88,28.38 29.88,25.62 32,23.5 32,20 34,18 | 5,17.25 v5.75,17.25 | TP101.TP$1 33,14.38 | v14.75,5 14.75,5.25 | 5,17.25 5,13 v9.5,8.5 v10,8 11.75,6.25 13.75,6.25 14.75,5.25
  Bottom 0.4: C606.1 v5.75,17.25 | D601.C v6,21.25 | v10,8 9.73,8.27 R608.2 9.34,8.5 v9.5,8.5 | C202.1 22.9,32.4 v23.25,32.75
  Bottom 0.5: IC202.IN 17.05,31.75 18.95,31.75 18.95,32.5 | 18.95,32.5 IC202.EN | C202.1 19.05,32.4 18.95,32.5 | v29.75,28.5 28.35,28.5 | IC701.IN 27.62,27.77 28.35,28.5 | C701.2 28.35,28.5 | IC606.IN 5.75,16.52 C606.1 | D601.C v6,20.5
BRAKE_LED_DRIVER:DIM_BRAKE_DRAIN  (via drill 0.35)
  other vias: 5.25,27.75 3.25,24.75 4.75,25.5 4.25,24.75 5.25,24.75 3.75,25.5 5.75,27 4.75,27 5.75,25.5 4.25,26.25 5.25,26.25 6.25,26.25
  pour Bottom (isolate 0.254, rank 2, no thermals): 0.5,24.1 11.4,24.1 0.5,36.44
  pour Top (isolate 0.254, rank 2, no thermals): 0.75,24 13.56,24 6.29,32 0.75,32
BRAKE_LED_DRIVER:DIM_BRAKE_GATE
  Bottom 0.25: IC607.3G 4.72,20.98 3.75,20 IC606.DRV
CAN_H
  Top 0.25: SJ501.2 32.25,24.5 TP105.TP$1
  Bottom 0.25: TP105.TP$1 32.58,24.43 IC501.P$7
CAN_INFRA:CAN_JMPR  (via drill 0.35)
  Top 0.25: SJ501.1 v31.75,26.5
  Bottom 0.25: v31.75,26.5 30.05,26.5 R505.2
CAN_L
  Bottom 0.25: R505.1 TP106.TP$1 30.5,23.25 31.93,21.82 IC501.P$6
CAN_RX  (via drill 0.35)
  Top 0.25: IC402.19_PA9-[PA11] 18.46,1.8 18.46,2.4 18.25,2.62 v18.25,2.75
  Route15 0.25: 25.18,2.15 25.59,2.34 29.75,6.5 30.77,6.5 31.36,7.09 31.36,7.91 30.75,8.53 v30.75,16.25 | v18.25,2.75 18.25,1.06 18.72,0.59 | 18.72,0.59 | 18.72,0.59 21.03,0.8 23.98,1.59 25.18,2.15 | 25.18,2.15
  Bottom 0.25: v30.75,16.25 31.27,16.25 IC501.P$4
CAN_TX  (via drill 0.35)
  Top 0.25: IC402.20_PA10-[PA12] v19,2.75
  Route2 0.25: v33.25,15.75 32.23,14.73 32.23,9.96 30.77,8.5 29.56,8.5 29.34,8.73 28.84,8.73 28.5,8.38 28.5,4.83 27.86,4.19 27.15,3.65 24.62,2.33 22.05,1.49 20.5,1.25 19.5,1.25 19,1.75 v19,2.75
  Bottom 0.25: IC501.P$1 33.25,16.73 v33.25,15.75
DIM_BRAKE  (via drill 0.35)
  Top 0.25: v2.25,16.5 0.75,16.25 arc81 16.5,0.63 IC402.15_PB1
  Bottom 0.25: IC606.DIM 2.79,16.5 v2.25,16.5 1.75,17 R101.2
DIM_REAR  (via drill 0.35)
  Top 0.25: IC402.23_PA15 v20.75,2.75
  Route15 0.25: v26.25,27.25 arc-65 v28.25,12 28.25,9.91 27.14,8.8 27.14,7.89 26.76,7.52 22.9,7.52 22.82,7.43 22.68,7.43 20.75,5.5 v20.75,2.75
  Bottom 0.25: IC701.DIM v26.25,27.25 26.25,26.62 R102.2
GND  (via drill 0.35)
  Top 0.25: IC402.16_VSS 17,2.15 16.83,2.32 16.83,2.83 17.75,3.75 18.25,3.75 v18.5,4
  other vias: 12,28.25 12.38,2.75 3.75,18 26.5,29 21,33.75 23.5,31.25 15.5,32.5 27.5,10 26.55,8.14 2.5,22.5 2.5,21.75 2.5,21 2.5,20.25 26,4.25 15,2.25 15.25,6 21.5,2.5 5.75,18.75 11.25,27.75 8,31 8.75,31.5
  pour Top (rank 3): 34.75,18 arc90 18,34.75 arc90 1.25,18 arc90 18,1.25 arc90
  pour Route2: 34.75,18 arc90 18,34.75 arc90 1.25,18 arc90 18,1.25 arc90
  pour Bottom (rank 3): 34.75,18 arc90 18,34.75 arc90 1.25,18 arc90 18,1.25 arc90
LED_AN
  Bottom 0.4: R608.1 6.31,11.82 5.19,11.82 TP103.TP$1 3.5,15 3.75,15.25 IC606.CSN
LED_CA
  Bottom 0.4: TP104.TP$1 9.75,31 9.75,30.75 10.34,30.16 L601.P$1
REAR_LED_DRIVER:CS  (via drill 0.35)
  Top 0.5: R702.1 26.12,31.62 v26.25,31.5
  Bottom 0.5: IC701.CS v26.25,31.5
REAR_LED_DRIVER:D1,D2  (via drill 0.35)
  Top 0.4: v23.62,6 23.85,5.9 D701.4
  Top 0.5: D702.2 v30,9.25
  Bottom 0.4: v23.62,6 23.62,5.5 25.62,3.5 27.43,3.5 30.35,6.42 30.81,6.42 31.44,7.05 31.44,8.2 30.38,9.25 v30,9.25
REAR_LED_DRIVER:D2,D3
  Top 0.4: D703.2
  Top 0.5: D703.2 D702.4
REAR_LED_DRIVER:D4,D5
  Top 0.5: D705.2 7.26,9.97 D704.4
REAR_LED_DRIVER:D5,D6
  Top 0.4: D706.2
  Top 0.5: D706.2 D705.4
REAR_LED_DRIVER:D7,D8
  Top 0.5: D707.4 D708.2
REAR_LED_DRIVER:D8,D9
  Top 0.5: D708.4 D709.2
REAR_LED_DRIVER:SINK  (via drill 0.35)
  Top 0.4: D706.4 3.72,22.03 v3.75,22 | D703.4
  Top 0.5: D703.4 30.82,26.48 D709.4 28.64,30.11 v27.25,31.5
  Route15 0.5: v27.25,31.5 27.25,31.25 26.75,30.75 25.25,30.75 24,32 16.5,32 16.25,31.75 12,31.75 10.5,30.25 8,30.25 7,29.25 7,25.25 v3.75,22
  Bottom 0.5: IC701.SINK 27.2,31.45 v27.25,31.5
SYS_NRST  (via drill 0.35)
  Top 0.25: C407.2 v27.82,8.14 | IC402.4_NRST 18.04,5.77 18.04,6.23 18.27,6.47 20.22,6.47 v20.25,6.5
  Bottom 0.25: v20.25,6.5 20.27,6.48 21.86,6.48 22.87,7.48 25.7,7.48 25.82,7.37 27.3,7.37 27.82,7.89 v27.82,8.14 C407.2
SYS_SWCLK  (via drill 0.35)
  Top 0.25: v27.82,6.86 SWD101.4_T_SWCLK 29.25,5.25 arc-37 20.25,1.25 20.08,1.42 IC402.22_PA14
SYS_SWDIO  (via drill 0.35)
  Top 0.25: v29.09,6.88 SWD101.2_T_SWDIO 30.35,5.68 arc-41 19.5,0.62 IC402.21_PA13

### Text on the board
Top: GND | GND | GND | GND
Route2: GND | GND | GND | GND
Route15: 3V3 | 3V3 | 3V3 | 3V3
Bottom: GND | GND | GND | GND
tPlace: H | L | CAN | BAT+ | GND
tNames: CTD | AND
tStop: MJ818 clone | ejovrh rev.5